# EAGLE design mano_rev_1_2_b (EAGLE 9.4.2)
DATE: 2019.07.02; REV: 1.2b
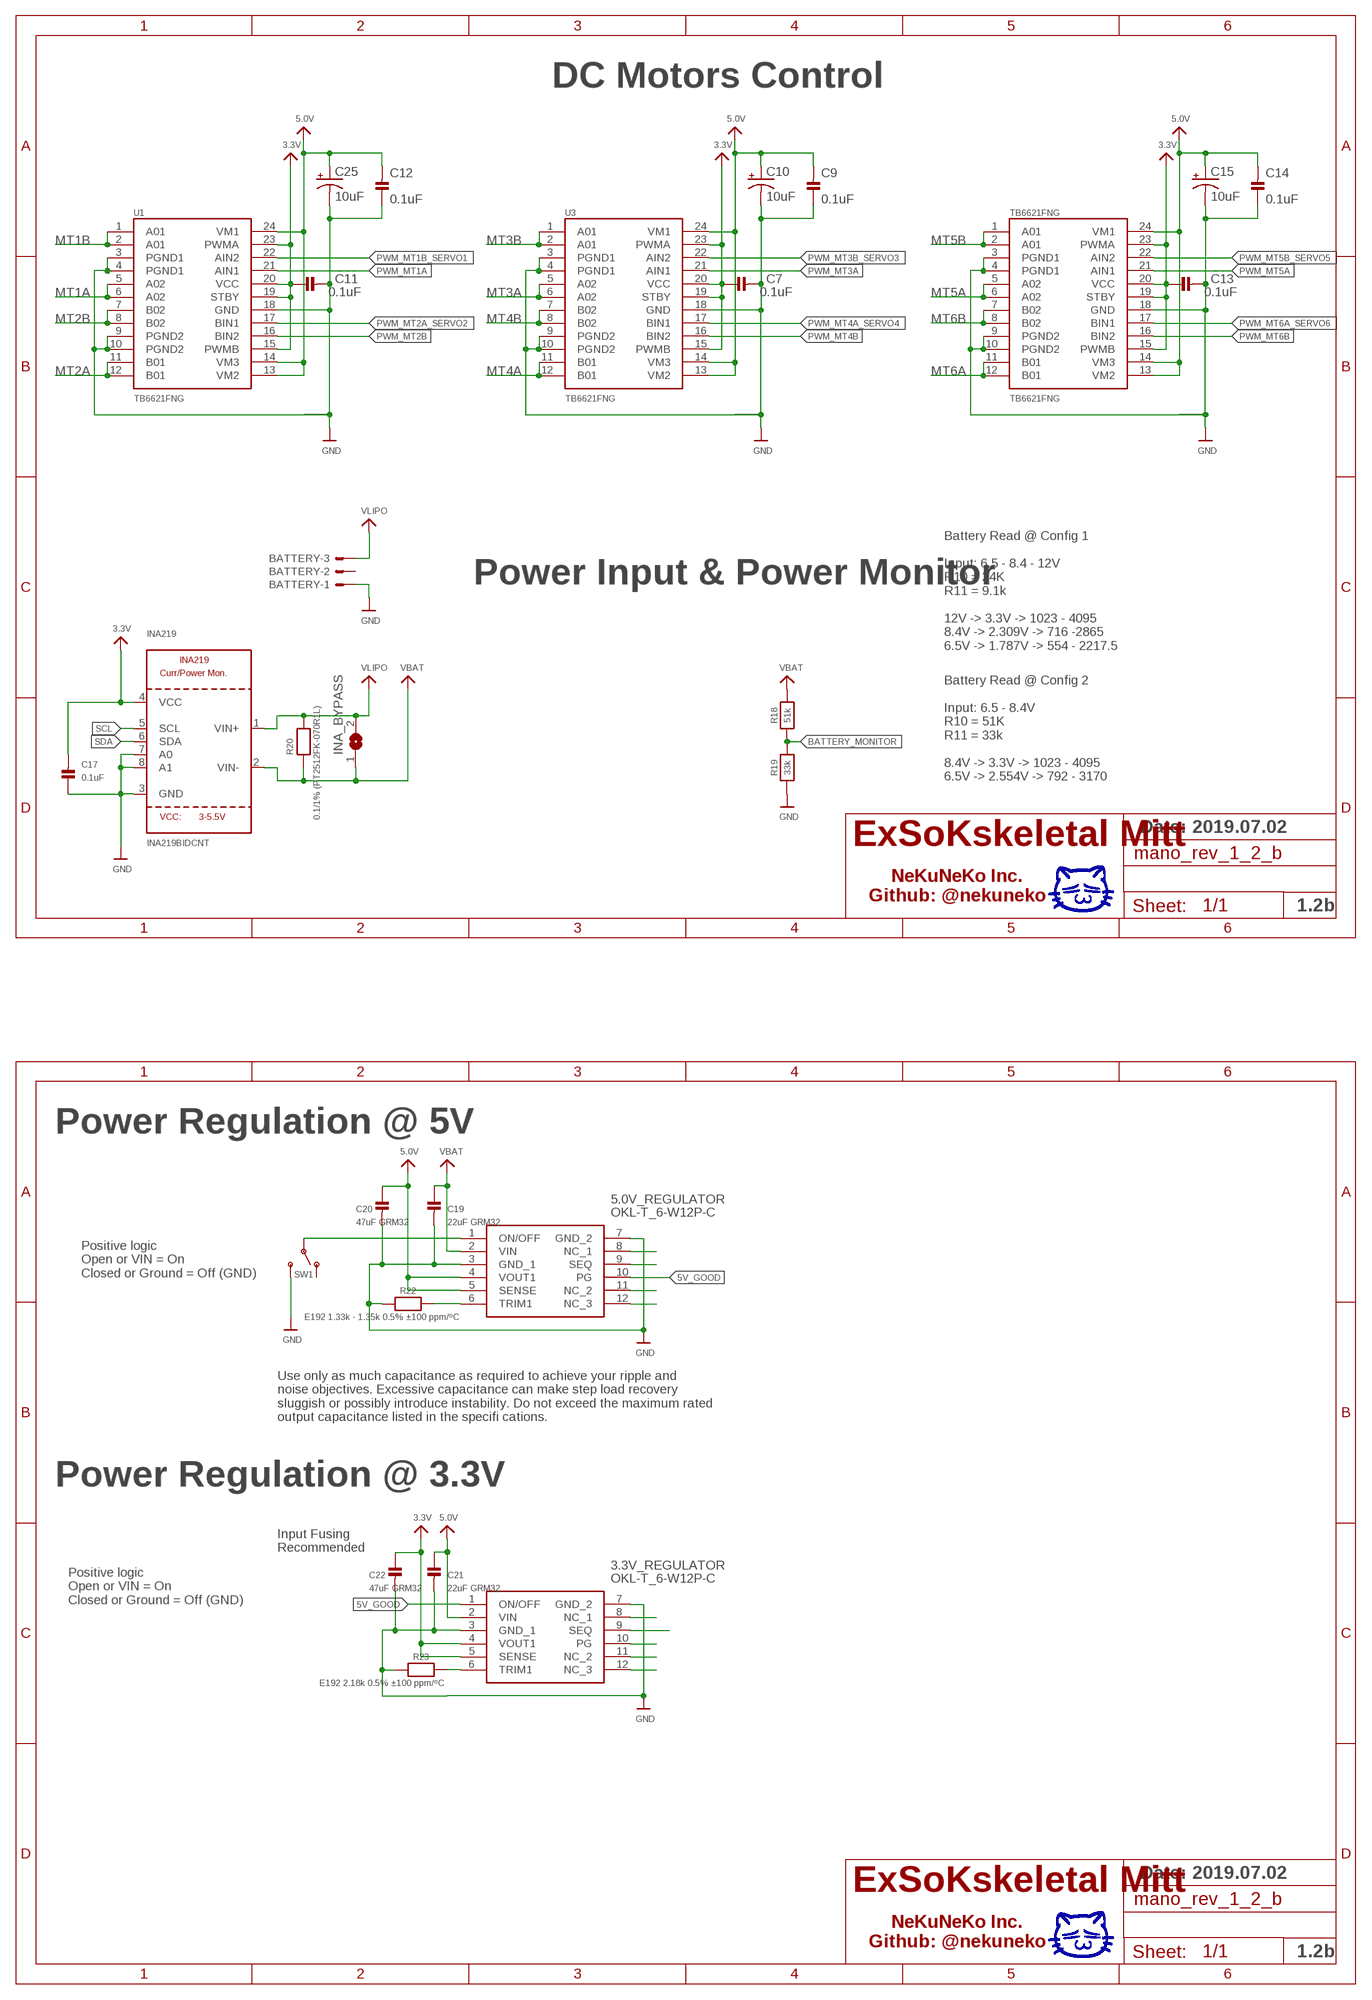
[diagram p0: schematic, sheet 1, part 1 of 2]
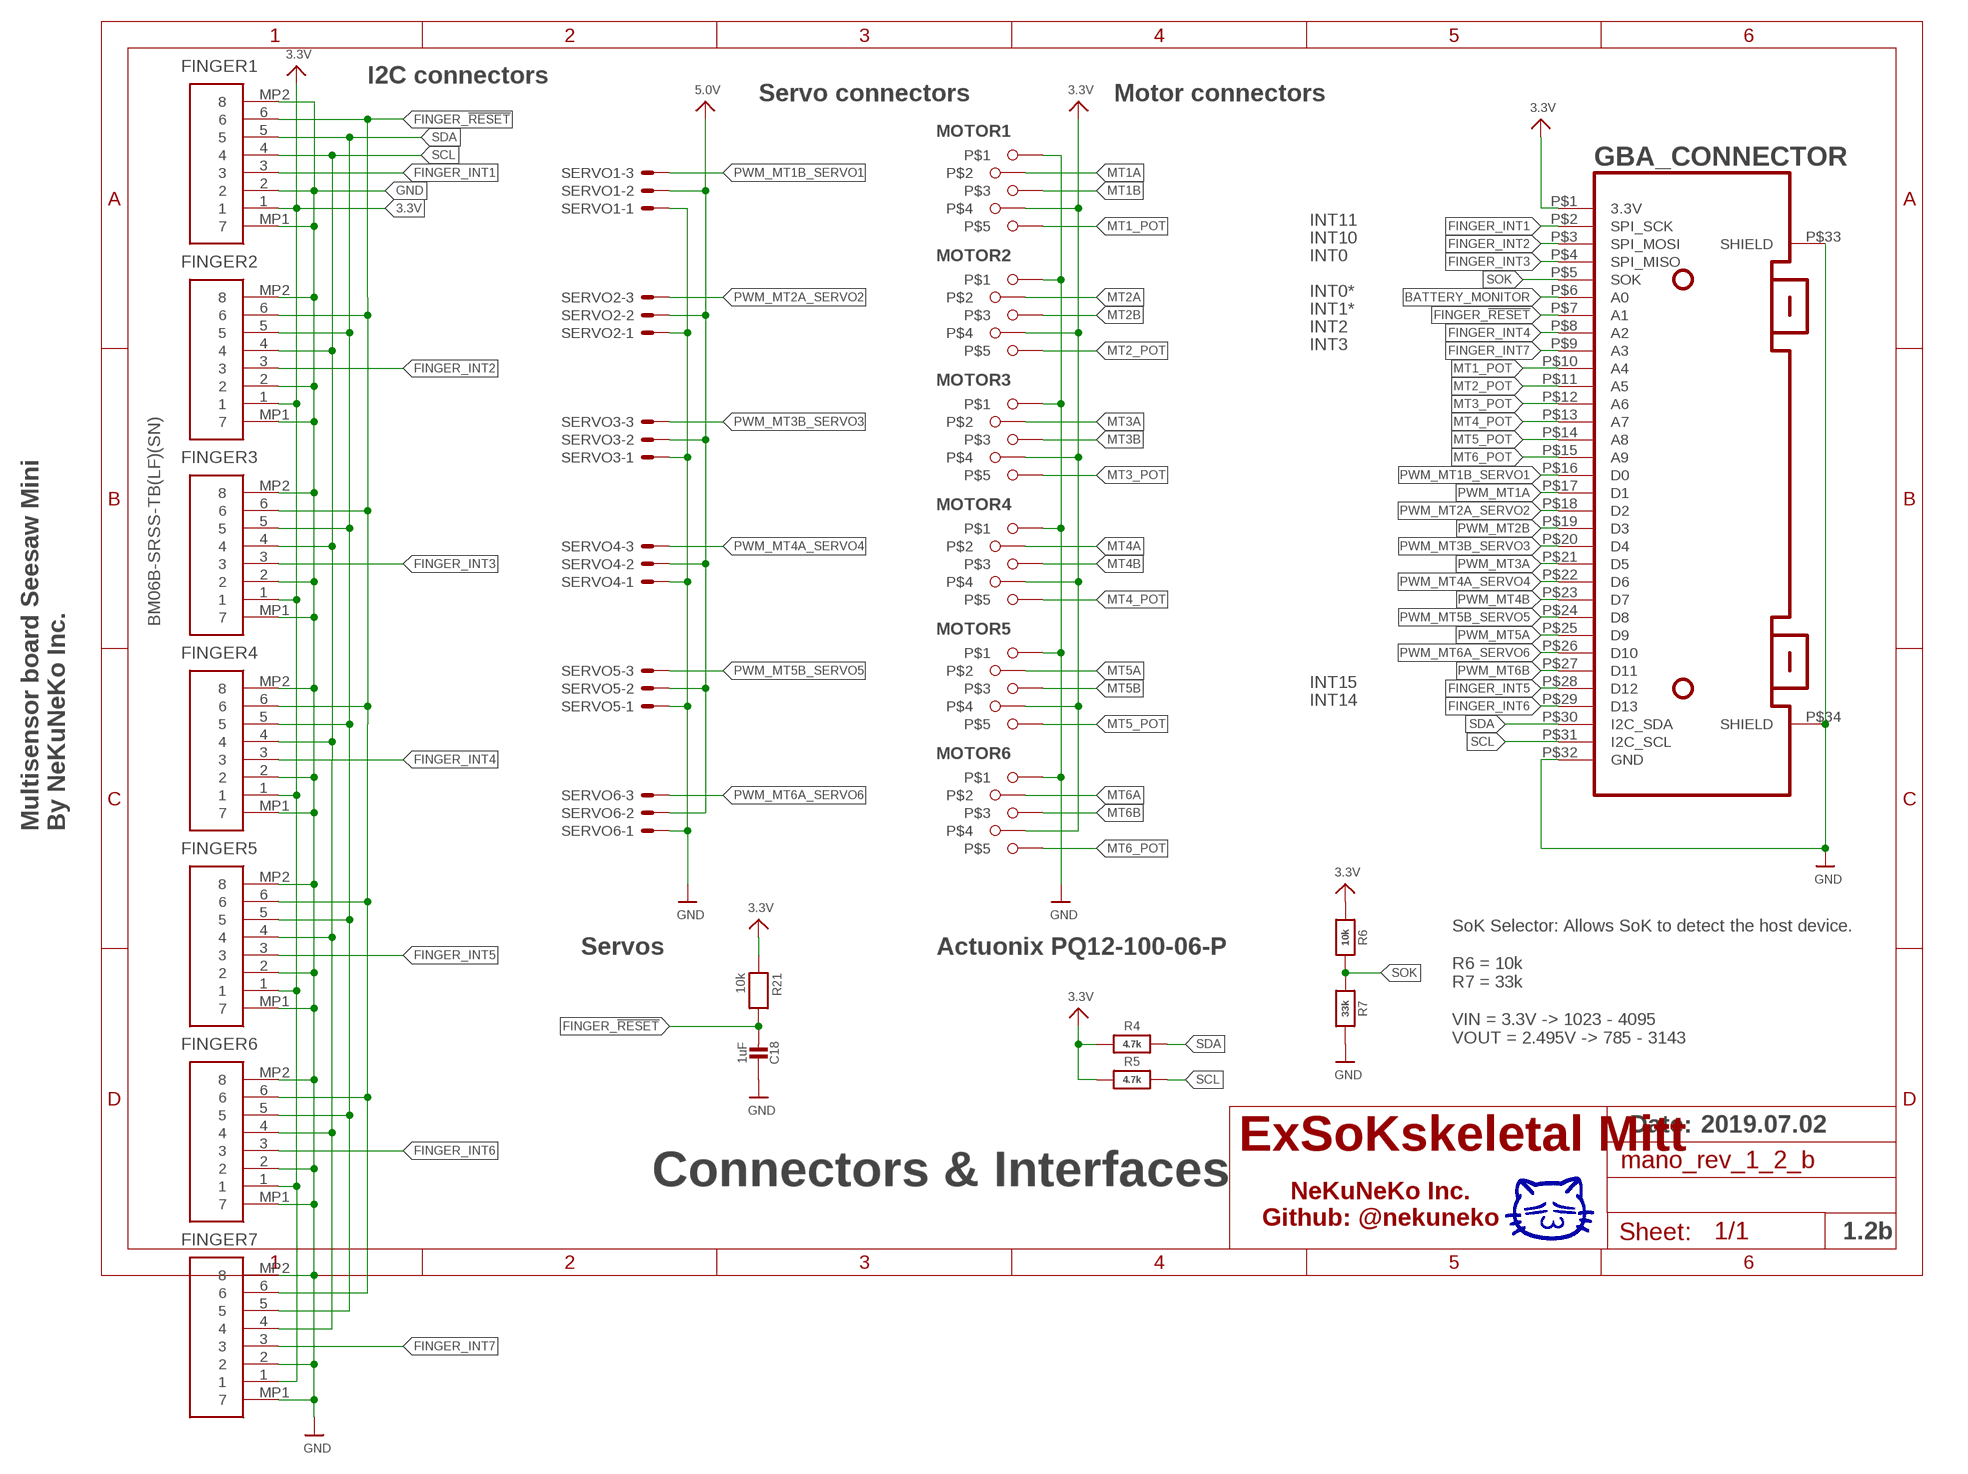
[diagram p1: schematic, sheet 1, part 2 of 2]

## Parts
3.3V_REGULATOR  OKL-T_6-W12P-C  [OKL-T3-W12]
5.0V_REGULATOR  OKL-T_6-W12P-C  [OKL-T3-W12]
BATTERY  JST-XH-03-PIN-LONG-PAD  [JST-XH-03-PACKAGE-LONG-PAD]
C7  0.1uF  CAP_CERAMIC_0603  [_0603]
C9  0.1uF  CAP_CERAMIC_0603  [_0603]
C10  10uF  10UF-POLAR-0603-6.3V-20%(TANT)  [0603-POLAR]
C11  0.1uF  CAP_CERAMIC_0603  [_0603]
C12  0.1uF  CAP_CERAMIC_0603  [_0603]
C13  0.1uF  CAP_CERAMIC_0603  [_0603]
C14  0.1uF  CAP_CERAMIC_0603  [_0603]
C15  10uF  10UF-POLAR-0603-6.3V-20%(TANT)  [0603-POLAR]
C17  0.1uF  CAP_CERAMIC_0603  [_0603]
C18  1uF  CAP_CERAMIC_0603  [MICROBUILDER__0603]
C19  22uF GRM32  CAP_CERAMIC1206  [1206]
C20  47uF GRM32  CAP_CERAMIC1206  [1206]
C21  22uF GRM32  CAP_CERAMIC1206  [1206]
C22  47uF GRM32  CAP_CERAMIC1206  [1206]
C25  10uF  10UF-POLAR-0603-6.3V-20%(TANT)  [0603-POLAR]
FINGER1  BM06B-SRSS-TB(LF)(SN)  [BM06BSRSSTBLFSN]
FINGER2  BM06B-SRSS-TB(LF)(SN)  [BM06BSRSSTBLFSN]
FINGER3  BM06B-SRSS-TB(LF)(SN)  [BM06BSRSSTBLFSN]
FINGER4  BM06B-SRSS-TB(LF)(SN)  [BM06BSRSSTBLFSN]
FINGER5  BM06B-SRSS-TB(LF)(SN)  [BM06BSRSSTBLFSN]
FINGER6  BM06B-SRSS-TB(LF)(SN)  [BM06BSRSSTBLFSN]
FINGER7  BM06B-SRSS-TB(LF)(SN)  [BM06BSRSSTBLFSN]
GBA_CONNECTOR  GBA_CARTRIDGEGBA_CARTRIDGE2  [GBA_CARTRIDGE2]
INA219  INA219BIDCNT  INA219  [SOT23-8]
INA_BYPASS  SOLDERJUMPERREFLOW_NOPASTE  [SOLDERJUMPER_REFLOW_NOPASTE]
MOTOR1  Actuonix PQ12-100-06-P  5PIN  [5PIN]
MOTOR2  Actuonix PQ12-100-06-P  5PIN  [5PIN]
MOTOR3  Actuonix PQ12-100-06-P  5PIN  [5PIN]
MOTOR4  Actuonix PQ12-100-06-P  5PIN  [5PIN]
MOTOR5  Actuonix PQ12-100-06-P  5PIN  [5PIN]
MOTOR6  Actuonix PQ12-100-06-P  5PIN  [5PIN]
R4  4.7k  RESISTOR_0603  [_0603]
R5  4.7k  RESISTOR_0603  [_0603]
R6  10k  RESISTOR_0603  [_0603]
R7  33k  RESISTOR_0603  [_0603]
R18  51k  RESISTOR_0603  [_0603]
R19  33k  RESISTOR_0603  [_0603]
R20  0.1/1% (PT2512FK-070R1L)  RESISTOR2512  [2512]
R21  10k  RESISTOR_0603  [_0603]
R22  E192 1.33k - 1.35k 0.5% ±100 ppm/ºC  RESISTOR_0603  [_0603]
R23  E192 2.18k 0.5% ±100 ppm/ºC  RESISTOR_0603  [_0603]
SERVO1  JST-XH-03-PIN-LONG-PAD  [JST-XH-03-PACKAGE-LONG-PAD]
SERVO2  JST-XH-03-PIN-LONG-PAD  [JST-XH-03-PACKAGE-LONG-PAD]
SERVO3  JST-XH-03-PIN-LONG-PAD  [JST-XH-03-PACKAGE-LONG-PAD]
SERVO4  JST-XH-03-PIN-LONG-PAD  [JST-XH-03-PACKAGE-LONG-PAD]
SERVO5  JST-XH-03-PIN-LONG-PAD  [JST-XH-03-PACKAGE-LONG-PAD]
SERVO6  JST-XH-03-PIN-LONG-PAD  [JST-XH-03-PACKAGE-LONG-PAD]
SW1  SWITCH_SPDT  [SPDT_SMT_SSSS811101]
TB6621FNG  TB6621FNG  [SSOP24]
U1  TB6621FNG  [SSOP24]
U3  TB6621FNG  [SSOP24]

## Nets
3.3V: 3.3V_REGULATOR.4(VOUT1) 3.3V_REGULATOR.5(SENSE) C7.1 C11.1 C13.1 C17.2 C22.1 FINGER1.1 FINGER2.1 FINGER3.1 FINGER4.1 FINGER5.1 FINGER6.1 FINGER7.1 GBA_CONNECTOR.P$1(3.3V) INA219.4(VCC) MOTOR1.4 MOTOR2.4 MOTOR3.4 MOTOR4.4 MOTOR5.4 MOTOR6.4 R4.1 R5.1 R6.1 R21.1 TB6621FNG.15(PWMB) TB6621FNG.19(STBY) TB6621FNG.20(VCC) TB6621FNG.23(PWMA) U1.15(PWMB) U1.19(STBY) U1.20(VCC) U1.23(PWMA) U3.15(PWMB) U3.19(STBY) U3.20(VCC) U3.23(PWMA)
5.0V: 3.3V_REGULATOR.2(VIN) 5.0V_REGULATOR.4(VOUT1) 5.0V_REGULATOR.5(SENSE) C9.2 C10.+ C12.2 C14.2 C15.+ C20.1 C21.1 C25.+ SERVO1.2 SERVO2.2 SERVO3.2 SERVO4.2 SERVO5.2 SERVO6.2 TB6621FNG.13(VM2) TB6621FNG.14(VM3) TB6621FNG.24(VM1) U1.13(VM2) U1.14(VM3) U1.24(VM1) U3.13(VM2) U3.14(VM3) U3.24(VM1)
5V_GOOD: 3.3V_REGULATOR.1(ON/OFF) 5.0V_REGULATOR.10(PG)
BATTERY_MONITOR: GBA_CONNECTOR.P$6(A0) R18.1 R19.2
FINGER_!RESET: C18.2 FINGER1.6 FINGER2.6 FINGER3.6 FINGER4.6 FINGER5.6 FINGER6.6 FINGER7.6 GBA_CONNECTOR.P$7(A1) R21.2
FINGER_INT1: FINGER1.3 GBA_CONNECTOR.P$2(SPI_SCK)
FINGER_INT2: FINGER2.3 GBA_CONNECTOR.P$3(SPI_MOSI)
FINGER_INT3: FINGER3.3 GBA_CONNECTOR.P$4(SPI_MISO)
FINGER_INT4: FINGER4.3 GBA_CONNECTOR.P$8(A2)
FINGER_INT5: FINGER5.3 GBA_CONNECTOR.P$28(D12)
FINGER_INT6: FINGER6.3 GBA_CONNECTOR.P$29(D13)
FINGER_INT7: FINGER7.3 GBA_CONNECTOR.P$9(A3)
GND [gnd]: 3.3V_REGULATOR.3(GND_1) 3.3V_REGULATOR.7(GND_2) 5.0V_REGULATOR.3(GND_1) 5.0V_REGULATOR.7(GND_2) BATTERY.1 C7.2 C9.1 C10.- C11.2 C12.1 C13.2 C14.1 C15.- C17.1 C18.1 C19.2 C20.2 C21.2 C22.2 C25.- FINGER1.2 FINGER1.MP1 FINGER1.MP2 FINGER2.2 FINGER2.MP1 FINGER2.MP2 FINGER3.2 FINGER3.MP1 FINGER3.MP2 FINGER4.2 FINGER4.MP1 FINGER4.MP2 FINGER5.2 FINGER5.MP1 FINGER5.MP2 FINGER6.2 FINGER6.MP1 FINGER6.MP2 FINGER7.2 FINGER7.MP1 FINGER7.MP2 GBA_CONNECTOR.P$32(GND) GBA_CONNECTOR.P$33(SHIELD) GBA_CONNECTOR.P$34(SHIELD) INA219.3(GND) INA219.7(A0) INA219.8(A1) MOTOR1.1 MOTOR2.1 MOTOR3.1 MOTOR4.1 MOTOR5.1 MOTOR6.1 R7.2 R19.1 R22.2 R23.2 SERVO1.1 SERVO2.1 SERVO3.1 SERVO4.1 SERVO5.1 SERVO6.1 SW1.C(S) TB6621FNG.3(PGND1) TB6621FNG.4(PGND1) TB6621FNG.9(PGND2) TB6621FNG.10(PGND2) TB6621FNG.18(GND) U1.3(PGND1) U1.4(PGND1) U1.9(PGND2) U1.10(PGND2) U1.18(GND) U3.3(PGND1) U3.4(PGND1) U3.9(PGND2) U3.10(PGND2) U3.18(GND)
MT1_POT: GBA_CONNECTOR.P$10(A4) MOTOR1.5
MT1A: MOTOR1.2 U1.5(A02) U1.6(A02)
MT1B: MOTOR1.3 U1.1(A01) U1.2(A01)
MT2_POT: GBA_CONNECTOR.P$11(A5) MOTOR2.5
MT2A: MOTOR2.2 U1.11(B01) U1.12(B01)
MT2B: MOTOR2.3 U1.7(B02) U1.8(B02)
MT3_POT: GBA_CONNECTOR.P$12(A6) MOTOR3.5
MT3A: MOTOR3.2 U3.5(A02) U3.6(A02)
MT3B: MOTOR3.3 U3.1(A01) U3.2(A01)
MT4_POT: GBA_CONNECTOR.P$13(A7) MOTOR4.5
MT4A: MOTOR4.2 U3.11(B01) U3.12(B01)
MT4B: MOTOR4.3 U3.7(B02) U3.8(B02)
MT5_POT: GBA_CONNECTOR.P$14(A8) MOTOR5.5
MT5A: MOTOR5.2 TB6621FNG.5(A02) TB6621FNG.6(A02)
MT5B: MOTOR5.3 TB6621FNG.1(A01) TB6621FNG.2(A01)
MT6_POT: GBA_CONNECTOR.P$15(A9) MOTOR6.5
MT6A: MOTOR6.2 TB6621FNG.11(B01) TB6621FNG.12(B01)
MT6B: MOTOR6.3 TB6621FNG.7(B02) TB6621FNG.8(B02)
N$2: 3.3V_REGULATOR.9(SEQ)
N$3: 5.0V_REGULATOR.8(NC_1)
N$4: 5.0V_REGULATOR.9(SEQ)
N$5: 5.0V_REGULATOR.6(TRIM1) R22.1
N$6: 5.0V_REGULATOR.11(NC_2)
N$7: 3.3V_REGULATOR.6(TRIM1) R23.1
N$8: 5.0V_REGULATOR.12(NC_3)
N$9: 3.3V_REGULATOR.8(NC_1)
N$10: 3.3V_REGULATOR.10(PG)
N$11: 3.3V_REGULATOR.11(NC_2)
N$12: 3.3V_REGULATOR.12(NC_3)
PWM_MT1A: GBA_CONNECTOR.P$17(D1) U1.21(AIN1)
PWM_MT1B_SERVO1: GBA_CONNECTOR.P$16(D0) SERVO1.3 U1.22(AIN2)
PWM_MT2A_SERVO2: GBA_CONNECTOR.P$18(D2) SERVO2.3 U1.17(BIN1)
PWM_MT2B: GBA_CONNECTOR.P$19(D3) U1.16(BIN2)
PWM_MT3A: GBA_CONNECTOR.P$21(D5) U3.21(AIN1)
PWM_MT3B_SERVO3: GBA_CONNECTOR.P$20(D4) SERVO3.3 U3.22(AIN2)
PWM_MT4A_SERVO4: GBA_CONNECTOR.P$22(D6) SERVO4.3 U3.17(BIN1)
PWM_MT4B: GBA_CONNECTOR.P$23(D7) U3.16(BIN2)
PWM_MT5A: GBA_CONNECTOR.P$25(D9) TB6621FNG.21(AIN1)
PWM_MT5B_SERVO5: GBA_CONNECTOR.P$24(D8) SERVO5.3 TB6621FNG.22(AIN2)
PWM_MT6A_SERVO6: GBA_CONNECTOR.P$26(D10) SERVO6.3 TB6621FNG.17(BIN1)
PWM_MT6B: GBA_CONNECTOR.P$27(D11) TB6621FNG.16(BIN2)
REG_5V_ON: 5.0V_REGULATOR.1(ON/OFF) SW1.B(P)
SCL: FINGER1.4 FINGER2.4 FINGER3.4 FINGER4.4 FINGER5.4 FINGER6.4 FINGER7.4 GBA_CONNECTOR.P$31(I2C_SCL) INA219.5(SCL) R5.2
SDA: FINGER1.5 FINGER2.5 FINGER3.5 FINGER4.5 FINGER5.5 FINGER6.5 FINGER7.5 GBA_CONNECTOR.P$30(I2C_SDA) INA219.6(SDA) R4.2
SOK: GBA_CONNECTOR.P$5(SOK) R6.2 R7.1
VBAT: 5.0V_REGULATOR.2(VIN) C19.1 INA219.2(VIN-) INA_BYPASS.1 R18.2 R20.1
VLIPO: BATTERY.3 INA219.1(VIN+) INA_BYPASS.2 R20.2
Unconnected: BATTERY.2 SW1.A(O)

## Notes on the sheet
- I2C connectors
- Servo connectors | Motor connectors
- DC Motors Control
- INT11
- INT10
- INT0
- INT0*
- INT1*
- INT2
- INT3
- INT15
- INT14
- Power Input & Power Monitor
- Multisensor board Seesaw Mini
  By NeKuNeKo Inc.
- Battery Read @ Config 1
  
  Input: 6.5 - 8.4 - 12V
  R10 = 24K
  R11 = 9.1k
  
  12V -> 3.3V -> 1023 - 4095
  8.4V -> 2.309V -> 716 -2865
  6.5V -> 1.787V -> 554 - 2217.5
- Servos | Actuonix PQ12-100-06-P
- SoK Selector: Allows SoK to detect the host device.
  
  R6 = 10k
  R7 = 33k 
  
  VIN = 3.3V -> 1023 - 4095
  VOUT = 2.495V -> 785 - 3143
- Battery Read @ Config 2
  
  Input: 6.5 - 8.4V
  R10 = 51K
  R11 = 33k
  
  8.4V -> 3.3V -> 1023 - 4095
  6.5V -> 2.554V -> 792 - 3170
- Date: | Date:
- ExSoKskeletal Mitt | ExSoKskeletal Mitt
- Connectors & Interfaces
- NeKuNeKo Inc.
  Github: @nekuneko
- NeKuNeKo Inc.
  Github: @nekuneko
- Power Regulation @ 5V
- Positive logic
  Open or VIN = On
  Closed or Ground = Off (GND)
- Use only as much capacitance as required to achieve your ripple and
  noise objectives. Excessive capacitance can make step load recovery
  sluggish or possibly introduce instability. Do not exceed the maximum rated
  output capacitance listed in the specifi cations.
- Power Regulation @ 3.3V
- Input Fusing
  Recommended
- Positive logic
  Open or VIN = On
  Closed or Ground = Off (GND)
- Date:
- ExSoKskeletal Mitt
- NeKuNeKo Inc.
  Github: @nekuneko

## Library data of the parts
3.3V_REGULATOR 5.0V_REGULATOR = SamacSys_Parts:OKL-T_6-W12P-C: MURATA POWER SOLUTIONS - OKL-T/6-W12P-C - DC-DC CONVERTER, 0.591V TO 5.5V, MODULE Source: Datasheet <https://power.murata.com/data/power/okl-t6-w12.pdf>; DESCRIPTION: MURATA POWER SOLUTIONS - OKL-T/6-W12P-C - DC-DC CONVERTER, 0.591V TO 5.5V, MODULE; HEIGHT: mm; MANUFACTURER_NAME: Murata Electronics; MANUFACTURER_PART_NUMBER: OKL-T/6-W12P-C; MOUSER_PART_NUMBER: 580-OKL-T/6-W12P-C; MOUSER_PRICE-STOCK: https://www.mouser.com/Search/Refine.aspx?Keyword=580-OKL-T%2F6-W12P-C
BATTERY SERVO1-SERVO6 = JST XH Connectors v1-0:JST-XH-03-PIN: JST XH Connector 2 Pin Wire to board connector. Pitch: 2,54 mm, (0.100") Number of pins: 3 Created by Rembrandt Electronics www.rembrandtelectronics.com
C7 C9 C11-C14 C17 C19-C22 = microbuilder:CAP_CERAMIC: Ceramic Capacitors
C10 C15 C25 = SparkFun-Capacitors:10UF-POLAR: 10.0µF polarized capacitors A capacitor is a passive two-terminal electrical component used to store electrical energy temporarily in an electric field.; MPN: F981A106MMA; PROD_ID: CAP-13210
C18 = m0express:CAP_CERAMIC: Ceramic Capacitors
FINGER1-FINGER7 = 0SoK:BM06B-SRSS-TB(LF)(SN): connector,multipole PCB use,BM06B-SRSS-T JST SH Series, 1mm Pitch 6 Way 1 Row Straight PCB Header, Solder Termination, 1A Source: Datasheet <http://docs-emea.rs-online.com/webdocs/13ce/0900766b813ce45e.pdf>; DESCRIPTION: connector,multipole PCB use,BM06B-SRSS-T JST SH Series, 1mm Pitch 6 Way 1 Row Straight PCB Header, Solder Termination, 1A; HEIGHT: 4.25mm; MANUFACTURER_NAME: JST (JAPAN SOLDERLESS TERMINALS); MANUFACTURER_PART_NUMBER: BM06B-SRSS-TB(LF)(SN); RS_PART_NUMBER: 5468782; RS_PRICE-STOCK: https://uk.rs-online.com/web/p/products/5468782
GBA_CONNECTOR = 0SoK:GBA_CARTRIDGE: GBA Cartridge Slot for NDS - from Aliexpress Gontak SoK main interface
INA219 = microbuilder:INA219: INA219 - I2C Current/Power Monitor Voltage Range: 0-26V Accuracy: 0.5% Temperature: -40°C - 125°C
INA_BYPASS = microbuilder:SOLDERJUMPER: SMD Solder JUMPER Solder the two pads together to create a connection, or remove the solder to break it. REFLOW - Use this footprint for solder paste and reflow ovens. WAVE - Use this footprint for hand-soldering (larger pads). CLOSED - Has a trace between the two pads to ensure it is closed by default. The trace needs to be cut to disable the jumper, and can be closed again by creating a solder bridge between the two pads.
MOTOR1-MOTOR6 = 0SoK:5PIN
R4-R7 R18-R23 = microbuilder:RESISTOR: Resistors 0402 - 0402 Surface Mount Package 22 Ohm 1% 1/16W [Digikey: 311-22.0LRTR-ND] 33 Ohm 5% 1/16W 1.0K 5% 1/16W 1.5K 5% 1/16W 2.0K 1% 1/16W 10.0K 1% 1/16W [Digikey: 311-10.0KLRTR-ND] 10.0K 5% 1/16W [Digikey: RMCF0402JT10K0TR-ND] 12.1K 1% 1/16W [Digikey: 311-22.0LRTR-ND] 100.0K 5% 1/16W 0603 - 0603 Surface Mount Package 0 Ohm 1/10 Watt 1% Resistor 15 Ohm 1/10 Watt 1% Resistor 33 Ohm 1/10 Watt 1% Resistor 49.9 Ohm 1/10 Watt 1% Resistor 100 Ohm 1/10 Watt 1% Resistor 150 Ohm 1/10 Watt 1% Resistor 240 Ohm 1/10 Watt 1% Resistor 390 Ohm 1/10 Watt 1% Resistor 560 Ohm 1/10 Watt 1% Resistor 680 Ohm 1/10 Watt 1% Resistor 750 Ohm 1/10 Watt 1% Resistor 1.0K Ohm 1/10 Watt 1% Resistor 1.5K Ohm 1/10 Watt 1% Resistor 2.0K Ohm 1/10 Watt 1% Resistor 2.2K Ohm 1/10 Watt 1% Resistor 3.3K Ohm 1/10 Watt 1% Resistor 4.7K Ohm 1/10 Watt 1% Resistor 10.0K Ohm 1/10 Watt 1% Resistor 12.0K Ohm 1/10 Watt 1% Resistor 12.1K Ohm 1/10 Watt 1% Resistor 20.0K Ohm 1/10 Watt 1% Resistor 33.0K Ohm 1/10 Watt 1% Resistor 100.0K Ohm 1/10 Watt 1% Resistor 0805 - 0805 Surface Mount Package 0 Ohm 1/8 Watt 1% Resistor 33 Ohm 1/8 Watt 1% Resistor 100 Ohm 1/8 Watt 1% Resistor 150 Ohm 1/8 Watt 1% Resistor 200 Ohm 1/8 Watt 1% Resistor 240 Ohm 1/8 Watt 1% Resistor 330 Ohm 1/8 Watt 1% Resistor 390 Ohm 1/8 Watt 1% Resistor 470 Ohm 1/8 Watt 1% Resistor 1.0K Ohm 1/8 Watt 1% Resistor 1.5K Ohm 1/8 Watt 1% Resistor 2.0K Ohm 1/8 Watt 1% Resistor 4.7K Ohm 1/8 Watt 1% Resistor 5.1K Ohm 1/8 Watt 1% Resistor 5.6K Ohm 1/8 Watt 1% Resistor 10.0K Ohm 1/8 Watt 1% Resistor 22.0K Ohm 1/8 Watt 1% Resistor 33.0K Ohm 1/8 Watt 1% Resistor 100K Ohm 1/8 Watt 1% Resistor 1206 - 1206 Surface Mount Package 2012 - 2010 Surface Mount Package 0.11 Ohm 1/2 Watt 1% Resistor - Digikey: RHM.11UCT-ND
SW1 = microbuilder:SWITCH_SPDT: Switch - SPDT SSSS811101 - Horizontal Two Position SMT, 0.3A 4V [Mouser: 688-SSSS811101]
TB6621FNG U1 U3 = SparkFun:TB6621FNG: Toshiba 1A motor driver

## Net classes
1 power: width 0.254 mm, drill 0.61 mm, clearance 0.254 mm
2 gnd: width 0.254 mm, drill 0.61 mm, clearance 0.254 mm

## Board
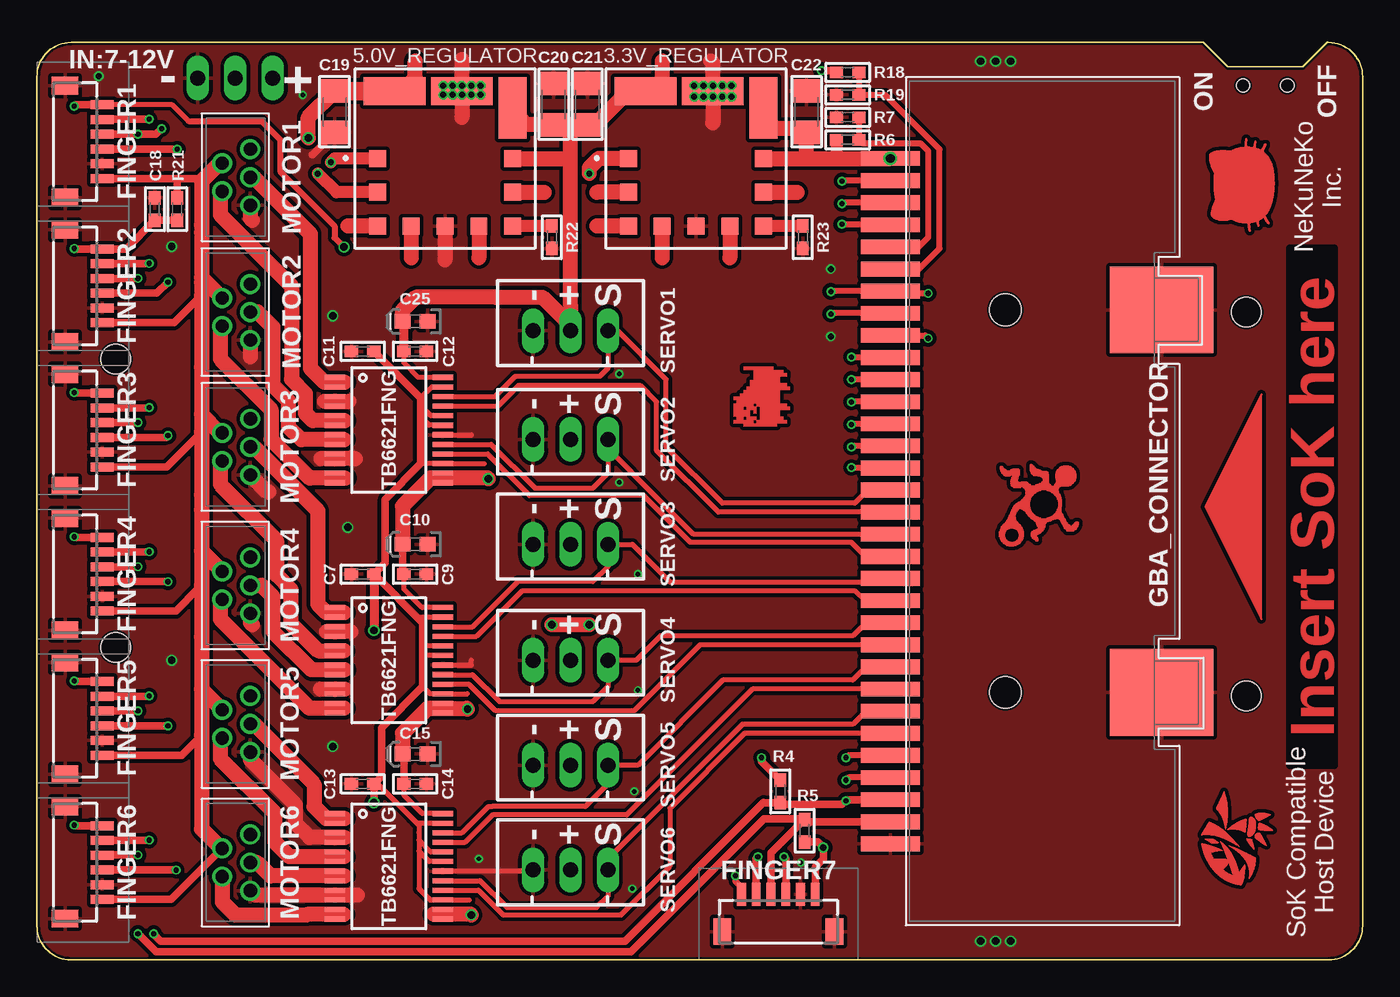
[diagram p2: board, top side]
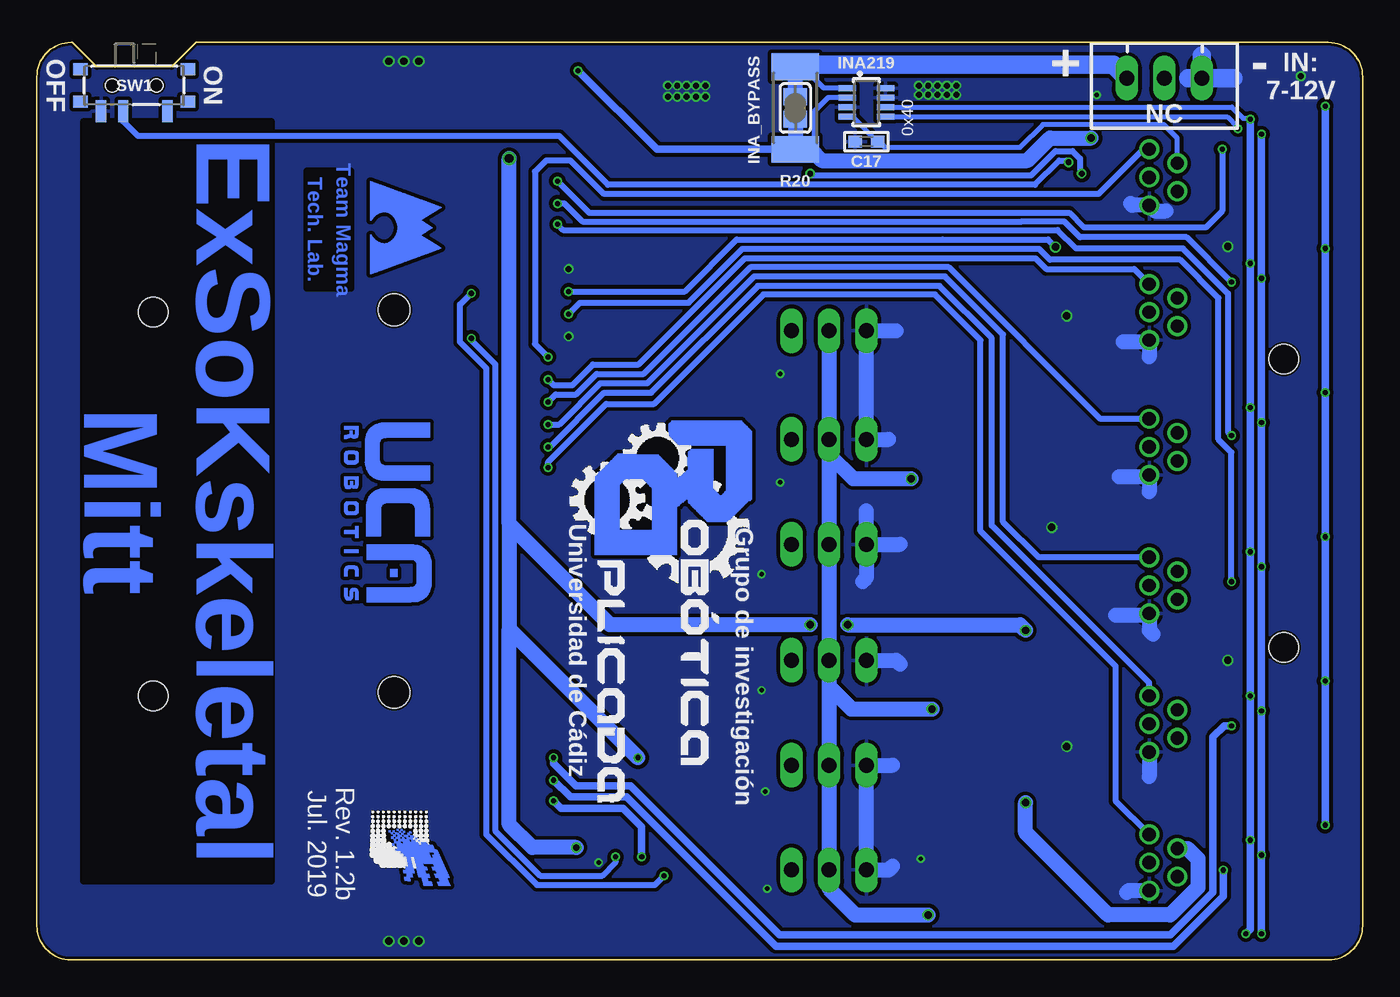
[diagram p3: board, bottom side, seen from below]

Size 89.92 x 62.23 mm. Coordinates in mm from the lower left corner, seen from the top.
Outline: 80.77,60.58 85.85,60.58 87.5,62.23 87.59,62.23 arc-90 89.92,59.91 89.92,2.32 arc-90 87.59,0 2.32,0 arc-90 0,2.32 0,59.91 arc-90 2.32,62.23 79.12,62.23 80.77,60.58
Copper layers (1*16): Top 0.035559375mm / dielectric 1.6mm / Bottom 0.035559375mm
Design rules "nekuneko": minimum track width 6mil, minimum drill 0.3mm, track to track 6mil, track to pad 6mil, pad to pad 6mil, via to via 6mil, smd to smd 6mil, copper to edge 6mil, drill to drill 6mil, minimum pad ring 5mil, minimum via ring 5mil, stop-mask expansion 2.5mil, vias tented up to drill 20mil, thermal gap 10mil
Holes 2 mm at 82.04,43.94 82.04,17.91 5.33,21.21 5.33,40.77
tRestrict: 4 lines

### Footprints (pad centres in the part's own frame; a part is rotated, then mirrored left to right if it is on the bottom)
OKL-T3-W12 = smd 1.15 x 1.15: 1 -4.57,0; 5 4.57,0; 6 4.57,-4.58; 7 0,-4.58; 8 -2.29,-4.58; 9 -4.57,-4.58; 10 -4.57,-2.29; 11 4.57,-2.29; 12 2.29,-4.58 | smd 4.19 x 1.91: 2 -3.43,4.57; 3 1.14,4.57 | smd 1.91 x 4.19: 4 4.57,3.43
JST-XH-03-PACKAGE-LONG-PAD = drill 1.016 long: 1 -2.54,0; 2 0,0; 3 2.54,0
_0603 = smd 0.9 x 0.8: 1 -0.762,0; 2 0.762,0
0603-POLAR = smd 1.1 x 1: + 0.85,0; - -0.85,0
MICROBUILDER__0603 = smd 0.9 x 0.8: 1 -0.762,0; 2 0.762,0
1206 = smd 1.6 x 1.8: 1 -1.4,0; 2 1.4,0
BM06BSRSSTBLFSN = smd 0.6 x 1.55: 1 -2.5,-1.65; 2 -1.5,-1.65; 3 -0.5,-1.65; 4 0.5,-1.65; 5 1.5,-1.65; 6 2.5,-1.65 | smd 1.2 x 1.8: MP1 -3.8,0.875; MP2 3.8,0.875
GBA_CARTRIDGE2 = smd 1 x 4: P$1 5.25,-1.3; P$2 6.75,-1.3; P$3 8.25,-1.3; P$4 9.75,-1.3; P$5 11.25,-1.3; P$6 12.75,-1.3; P$7 14.25,-1.3; P$8 15.75,-1.3; P$9 17.25,-1.3; P$10 18.75,-1.3; P$11 20.25,-1.3; P$12 21.75,-1.3; P$13 23.25,-1.3; P$14 24.75,-1.3; P$15 26.25,-1.3; P$16 27.75,-1.3; P$17 29.25,-1.3; P$18 30.75,-1.3; P$19 32.25,-1.3; P$20 33.75,-1.3; P$21 35.25,-1.3; P$22 36.75,-1.3; P$23 38.25,-1.3; P$24 39.75,-1.3; P$25 41.25,-1.3; P$26 42.75,-1.3; P$27 44.25,-1.3; P$28 45.75,-1.3; P$29 47.25,-1.3; P$30 48.75,-1.3; P$31 50.25,-1.3; P$32 51.75,-1.3 | smd 5.88 x 7: P$33 15.525,17.1; P$34 41.475,17.1 | hole 2.159: 41.475,6.504; 15.525,6.504
SOT23-8 = smd 0.4 x 1.2: 1 -0.975,-1.3; 2 -0.325,-1.3; 3 0.325,-1.3; 4 0.975,-1.3; 5 0.975,1.3; 6 0.325,1.3; 7 -0.325,1.3; 8 -0.975,1.3
SOLDERJUMPER_REFLOW_NOPASTE = smd 1.168 x 1.6: 1 -0.762,0; 2 0.762,0
5PIN = drill 0.9: 1 -1.905,0; 2 -0.953,1.905; 3 0,0; 4 0.953,1.905; 5 1.905,0
2512 = smd 1.8 x 3.2: 1 -2.8,0; 2 2.8,0
SPDT_SMT_SSSS811101 = smd 0.7 x 1.5: A -2.25,1.75; B 0.75,1.75; C 2.25,1.75 | smd 1 x 0.8: SUP1 -3.65,1.1; SUP2 -3.65,-1.1; SUP3 3.65,1.1; SUP4 3.65,-1.1 | hole 0.9: -1.5,0; 1.5,0
SSOP24 = smd 0.348 x 1.397: 1 -3.575,-3.656; 2 -2.925,-3.656; 3 -2.275,-3.656; 4 -1.625,-3.656; 5 -0.975,-3.656; 6 -0.325,-3.656; 7 0.325,-3.656; 8 0.975,-3.656; 9 1.625,-3.656; 10 2.275,-3.656; 11 2.925,-3.656; 12 3.575,-3.656; 13 3.575,3.656; 14 2.925,3.656; 15 2.275,3.656; 16 1.625,3.656; 17 0.975,3.656; 18 0.325,3.656; 19 -0.325,3.656; 20 -0.975,3.656; 21 -1.625,3.656; 22 -2.275,3.656; 23 -2.925,3.656; 24 -3.575,3.656

### Placement (x,y rotation side)
3.3V_REGULATOR  44.7,54.36 0 top
5.0V_REGULATOR  27.69,54.36 0 top
BATTERY  13.46,59.82 180 bottom
C7  22.1,26.16 180 top
C9  25.65,26.16 180 top
C10  25.65,28.19 180 top
C11  22.1,41.27 180 top
C12  25.65,41.27 180 top
C13  22.1,11.94 180 top
C14  25.65,11.94 180 top
C15  25.65,13.97 180 top
C17  33.66,55.5 0 bottom
C18  8,50.93 270 top
C19  20.19,57.53 270 top
C20  35.05,58.04 90 top
C21  37.34,58.04 90 top
C22  52.2,57.53 90 top
C25  25.65,43.31 180 top
FINGER1  2.79,55.5 90 top
FINGER2  2.79,45.72 90 top
FINGER3  2.79,35.94 90 top
FINGER4  2.79,26.16 90 top
FINGER5  2.79,16.38 90 top
FINGER6  2.79,6.6 90 top
FINGER7  50.29,2.79 180 top
GBA_CONNECTOR  59.18,59.62 270 top
INA219  33.66,58.17 270 bottom
INA_BYPASS  38.48,57.78 90 bottom
MOTOR1  14.48,53.09 90 top
MOTOR2  14.48,43.94 90 top
MOTOR3  14.48,34.8 90 top
MOTOR4  14.48,25.4 90 top
MOTOR5  14.48,16 90 top
MOTOR6  14.48,6.6 90 top
R4  2.2k  [_0603]  50.42,11.43 270 top
R5  2.2k  [_0603]  52.07,8.76 90 top
R6  54.99,55.63 0 top
R7  54.99,57.15 180 top
R18  54.99,60.2 180 top
R19  54.99,58.67 0 top
R20  38.48,57.78 90 bottom
R21  9.53,50.93 270 top
R22  34.92,49.02 270 top
R23  51.94,49.02 270 top
SERVO1  36.2,42.67 0 top
SERVO2  36.2,35.31 0 top
SERVO3  36.2,28.19 0 top
SERVO4  36.2,20.32 0 top
SERVO5  36.2,13.21 0 top
SERVO6  36.2,6.1 0 top
SW1  83.31,59.31 180 bottom
TB6621FNG  23.88,6.35 270 top
U1  23.88,35.94 270 top
U3  23.88,20.32 270 top
U$6  [NEKO_6_5_BORDE_TSTOP]  83.95,49.4 90 top
U$7  [SOK_FINISH]  84.07,4.95 90 top
U$8  [DOG_FINISH]  51.31,35.94 90 top
U$9  [MAGMA]  67.31,52.83 270 bottom
U$14  [UCAROBOTICS]  69.34,36.7 270 bottom
U$48  [GIRA_2_DRAWN_14]  54.36,36.7 270 bottom
U$50  [TRIANGLE]  79.25,30.73 0 top
U$51  [DIGIMON]  67.31,10.16 270 bottom
U$52  [BUGS_6]  70.87,27.81 90 top

### Tracks (layer width: path | path; a pad name or v marks a point on that pad's centre or on a via)
3.3V  (via drill 0.35, 0.45, 0.5, 0.61)
  Top 0.35: 26.16,20.83 26.16,18.54 26.66,18.05 U3.15 29.2,18.05 | 26.16,20.83 26.16,21.08 26.16,21.34 | 26.16,21.34 26.16,21.84 26.16,22.86 26.16,23.11 26.03,23.25 U3.23 | U3.20 26.2,21.3 26.16,21.34 | U3.19 26.34,20.64 26.16,20.83 | 27.43,38.87 U1.23 26.8,38.87 26.04,38.1 | C13.1 23.11,11.94 25.4,9.65 25.65,9.4 | 25.91,8.13 25.91,8.64 25.91,9.14 25.65,9.4 | 25.91,8.13 25.91,7.37 | 25.91,7.37 25.91,4.83 26.66,4.08 TB6621FNG.15 29.33,4.08 | TB6621FNG.19 26.6,6.67 25.91,7.37 | TB6621FNG.20 26.71,7.33 25.91,8.13 | TB6621FNG.23 25.78,9.28 25.65,9.4 | U1.20 26.71,36.92 26.04,37.59 | U1.19 26.6,36.27 26.04,36.83 | 26.04,33.66 26.05,33.67 U1.15 30.34,33.67
  Top 0.508: MOTOR6.4 9.12,4.1 FINGER6.1 | 10.92,14.99 11.18,15.24 9.82,13.88 FINGER5.1 | 11.18,25.4 10.92,25.15 9.46,23.69 9.44,23.66 FINGER4.1 | 9.53,53 9.14,53 8.89,53 8.76,53 8,53 7.11,53 FINGER1.1 | 9.53,53 9.65,53 11.53,53 MOTOR1.4 | MOTOR5.4 12.45,17.08 | 26.16,22.86 C7.1 23.62,26.92 23.62,31.24 26.04,33.66 26.04,36.83 26.04,37.59 26.04,38.1 C11.1 | 26.16,23.11 26.16,18.54 23.37,15.75 23.37,12.45 C13.1 v22.86,10.67 | v49.15,13.72 49.15,13.46 R4.1 | R5.1 52.96,8 v53.34,7.62 53.34,6.86 52.79,6.31 FINGER7.1 | R21.1 9.53,53 | FINGER2.1 9.31,43.22 11.18,45.09 | FINGER3.1 8.8,33.44 11.18,35.81 11.18,37.02
  Top 0.61: C7.1 v22.86,22.35
  Top 0.813: R6.1 54.23,54.37
  Top 1.016: MOTOR1.4 12.38,54.04 11.18,52.83 11.18,49.85 | 11.18,49.85 11.18,46.29 MOTOR2.4 | 11.18,49.85 11.18,49.34 | 11.18,49.34 11.18,45.97 11.18,45.09 | 11.18,49.34 11.18,44.96 11.18,37.02 12.45,35.75 MOTOR3.4 | 11.18,31.56 11.18,35.81 11.18,40.2 | 11.18,31.56 11.18,27.75 MOTOR4.4 | 11.18,31.56 11.18,30.54 11.18,25.4 11.18,21.91 11.18,18.35 | MOTOR5.4 11.3,18.22 11.18,18.35 | MOTOR6.4 12.51,7.56 11.18,8.89 11.18,15.24 11.18,18.35 | v37.47,22.73 v34.92,22.73 | 3.3V_REGULATOR.5 49.28,54.37 52.07,54.37 | 52.07,54.37 54.23,54.37 GBA_CONNECTOR.P$1 | 52.07,54.37 52.2,54.49 C22.1 51.94,56.39 49.53,56.39 49.53,57.15 49.27,57.41 3.3V_REGULATOR.4
  Bottom 0.152: 57.88,22.48 57.88,22.45
  Bottom 0.35: MOTOR1.4 12.57,55.75 13.48,56.66 21.7,56.66 23.24,55.12 32.38,55.12 32.77,55.5 C17.2 34.59,57.19 INA219.4 35.21,57.19
  Bottom 1.016: v22.86,22.35 23.24,22.73 v34.92,22.73 | v37.47,22.73 51.05,22.73 57.88,29.56 | MOTOR6.4 11.87,7.56 11.18,6.86 11.18,4.92 13.05,3.05 17.27,3.05 22.86,8.64 v22.86,10.67 | 57.88,29.56 GBA_CONNECTOR.P$1 | 57.88,29.56 57.88,22.48 | v49.15,13.72 57.88,22.45 57.88,21.97 57.88,9.17 56.33,7.62 v53.34,7.62
  other vias: 57.88,54.37
5.0V  (via drill 0.5)
  Top 0.35: TB6621FNG.13 27.23,2.77 26.9,3.1 27.2,3.1 TB6621FNG.14 | U3.13 27.21,17.07 26.75,17.07 | 26.75,17.07 26.5,17.07 | U3.14 27.2,17.07 26.75,17.07 | TB6621FNG.24 26.14,9.93 24.89,11.18 C14.2 | U1.24 25.89,39.52 24.89,40.51 C12.2 | U3.24 26.14,23.89 24.89,25.15 C9.2 | U1.14 30.23,33.02 30.56,32.69 30.68,32.56 30.62,32.63 | v30.61,32.64 30.61,32.37 U1.13
  Top 0.508: C14.2 24.89,13.88 C15.+ | C9.2 24.8,26.25 C10.+
  Top 0.61: C12.2 24.89,43.22 C25.+
  Top 0.813: C25.+ 24.93,43.31
  Top 1.016: v29.46,3.05 29.41,3.1 26.9,3.1 | v29.21,17.02 29.16,17.07 26.75,17.07 | 26.5,17.07 24.8,15.37 C15.+ | C10.+ 24.8,30.78 26.71,32.69 30.56,32.69 | v30.61,32.64 30.62,32.63 | C25.+ 24.8,44.07 25.69,44.96 31.11,44.96 34.29,44.96 36.2,43.05 | 36.2,43.05 36.2,44.45 36.2,54.48 | 36.2,43.05 SERVO1.2 | C20.1 34.92,56.77 | 32.9,57.02 32.26,57.66 5.0V_REGULATOR.4 32.26,57.15 32.77,56.64 C20.1 | 36.2,54.48 36.2,56.64 | 36.2,56.64 C20.1 | 36.2,56.64 C21.1 37.84,56.64 40.13,58.93 3.3V_REGULATOR.2 42.29,58.93 42.42,59.05 42.42,60.96 | 36.2,54.48 36.07,54.36 5.0V_REGULATOR.5
  Bottom 1.016: SERVO4.2 SERVO5.2 SERVO6.2 36.2,4.83 34.42,3.05 v29.46,3.05 | SERVO4.2 SERVO3.2 36.2,33.53 36.2,34.29 | 36.2,34.29 36.2,34.54 36.2,35.05 SERVO2.2 SERVO1.2 | SERVO4.2 36.2,18.54 34.67,17.02 v29.21,17.02 | 36.2,34.29 34.54,32.64 v30.61,32.64
5V_GOOD  (via drill 0.4)
  Top 0.813: 5.0V_REGULATOR.10 20.32,52.07 v19.05,53.34
  Top 1.016: 3.3V_REGULATOR.1 38.1,54.36 37.47,53.72 v37.47,53.34
  Bottom 0.406: v37.47,53.34 37.34,53.21 22.48,53.21 20.83,54.86 19.68,54.86 19.18,54.36 19.18,53.47 v19.05,53.34
BATTERY_MONITOR
  Top 0.406: GBA_CONNECTOR.P$6 59.64,46.69 61.21,48.26 61.21,54.99 57.53,58.67 R19.2 R18.1
FINGER_!RESET  (via drill 0.35, 0.5)
  Top 0.35: FINGER1.6 4.48,58.04 9.14,58.04 10.29,56.9
  Top 0.406: 10.29,56.9 15.24,56.9 16.51,55.63 16.51,53.47 20.19,49.78 20.19,48.99 v20.83,48.35 | v47.37,5.71 47.37,5.33 47.79,4.91 | v60.45,45.21 57.91,45.21 GBA_CONNECTOR.P$7 53.87,45.37 v53.85,45.34
  Top 0.508: R21.2 C18.2 6.06,48.22 FINGER2.6 2.58,48.22 v2.54,48.26 | v2.54,9.14 2.58,9.1 FINGER6.6 | FINGER5.6 2.58,18.88 v2.54,18.92 | FINGER4.6 2.58,28.66 v2.54,28.7 | FINGER3.6 2.58,38.44 v2.54,38.48 | FINGER1.6 2.63,58 v2.54,57.91 | FINGER7.6 47.79,4.91
  Bottom 0.406: v20.83,48.35 21.34,48.86 28.5,48.86 42.45,48.86 45.97,45.34 v53.85,45.34 | v60.45,45.21 61.21,44.45 61.21,41.91 59.44,40.13 59.44,8.51 56.01,5.08 48.01,5.08 v47.37,5.71
  Bottom 0.508: v2.54,9.14 v2.54,18.92 2.54,28.57 v2.54,28.7 v2.54,38.48 v2.54,48.26 v2.54,57.91
FINGER_INT1  (via drill 0.35)
  Top 0.406: GBA_CONNECTOR.P$2 54.64,52.87 v54.61,52.83
  Top 0.508: FINGER1.3 9.52,55 v9.53,54.99
  Bottom 0.406: v9.53,54.99 9.53,50.8 10.64,49.68 18.9,49.68 19.89,50.67 52.45,50.67 v54.61,52.83
FINGER_INT2  (via drill 0.35)
  Top 0.406: 57.84,51.23 GBA_CONNECTOR.P$3 54.67,51.37 v54.61,51.31
  Top 0.508: FINGER2.3 8.14,45.22 v8.89,45.97
  Bottom 0.406: v54.61,51.31 54.14,51.31 52.91,50.08 23.11,50.08 20.24,50.08 19.18,49.02 11.94,49.02 v8.89,45.97
FINGER_INT3  (via drill 0.35)
  Top 0.406: GBA_CONNECTOR.P$4 54.63,49.87 v54.6,49.9
  Top 0.508: FINGER3.3 8.77,35.44 v8.89,35.56
  Bottom 0.406: v8.89,35.56 9.14,35.81 9.14,45.21 12.19,48.26 19.43,48.26 20.69,49.52 54.22,49.52 v54.6,49.9
FINGER_INT4  (via drill 0.35)
  Top 0.406: v8.89,25.65 8.88,25.66 | 57.88,43.69 GBA_CONNECTOR.P$8 53.9,43.87 v53.85,43.81
  Top 0.508: 8.88,25.66 FINGER4.3
  Bottom 0.406: v53.85,43.81 53.09,44.58 45.72,44.58 42.06,48.23 21.95,48.23 21.21,47.5 12.38,47.5 9.78,44.9 9.78,35.31 8.89,34.42 v8.89,25.65
FINGER_INT5  (via drill 0.35)
  Top 0.406: GBA_CONNECTOR.P$28 55.01,13.87 v54.86,13.72
  Top 0.508: FINGER5.3 8.76,15.88 v8.88,15.88 v8.89,15.88
  Bottom 0.508: v54.86,13.72 54.86,13.34 53.34,11.81 49.66,11.81 39.55,1.7 13.03,1.7 10.16,4.57 10.16,15.11 9.4,15.88 v8.89,15.88
FINGER_INT6  (via drill 0.35)
  Top 0.406: GBA_CONNECTOR.P$29 55.04,12.37 v54.86,12.19
  Top 0.508: 57.88,12.19 GBA_CONNECTOR.P$29 | FINGER6.3 v9.44,6.1 v9.45,6.1
  Bottom 0.508: v9.45,6.1 9.45,4.32 12.83,0.94 39.8,0.94 49.91,11.05 53.72,11.05 v54.86,12.19
FINGER_INT7  (via drill 0.35)
  Top 0.406: GBA_CONNECTOR.P$9 60.25,42.37 v60.45,42.16
  Top 0.508: FINGER7.3 50.79,6.87 v50.67,6.99
  Bottom 0.406: v50.67,6.99 50.67,6.6 51.56,5.71 55.78,5.71 58.83,8.77 58.83,40.41 59.33,40.92 60.45,42.04 v60.45,42.16
GND  (via drill 0.3, 0.4, 0.5)
  Top 0.254: U1.4 19.9,37.89 19.5,37.89 19.83,38.22 U1.3
  Top 0.35: TB6621FNG.3 20.57,8.62 20.89,8.3 20.57,7.97 TB6621FNG.4 | SERVO6.1 33.58,6.03 TB6621FNG.18 | U3.9 20.55,18.7 20.89,18.36 20.53,18.36 U3.10 | U3.18 29.46,20 29.46,20.32 | U1.18 29.46,35.62 29.46,35.57
  Top 0.508: C19.2 19.43,55.37 19.43,55.33 18.71,54.61 18.67,54.61
  Top 1.016: MOTOR5.1 14.48,13.59 17.53,10.54 17.53,9.27 18.5,8.3 20.89,8.3 | 21.73,4.39 14.79,4.39 MOTOR6.1 | 14.48,23.11 MOTOR4.1 14.48,22.88 14.61,22.74 | 20.89,18.36 19.23,18.36 | MOTOR2.1 14.48,40.89 | 21.29,22.27 19.63,22.27 | 19.5,37.89 21.16,37.89 | 21.59,34 19.25,34 | MOTOR1.1 14.48,50.31 14.61,50.17 | MOTOR3.1 15.62,31.75 15.75,31.75 | 5.0V_REGULATOR.7 27.69,47.5 | 28.83,61.09 28.83,61.08 5.0V_REGULATOR.3 28.83,57.15 | 45.72,60.96 45.84,60.84 3.3V_REGULATOR.3 45.85,56.77
  Bottom 1.016: MOTOR6.1 15.88,4.7 16,4.57 | MOTOR5.1 14.48,12.45 | 14.22,22.1 14.48,22.35 MOTOR4.1 14.61,23.37 16.76,23.37 | 14.48,31.75 MOTOR3.1 14.61,32.77 16.51,32.77 | 14.48,40.89 MOTOR2.1 14.61,41.91 16.26,41.91 | SERVO4.1 31.62,20.32 31.37,20.07 | 31.88,13.21 SERVO5.1 SERVO6.1 32.13,6.1 31.88,6.35 | SERVO3.1 33.66,25.91 33.91,25.65 | SERVO3.1 31.37,28.19 | SERVO3.1 33.66,30.48 | 32.13,35.31 SERVO2.1 SERVO1.1 31.62,42.67 | 15.75,51.31 15.62,51.18 MOTOR1.1 14.1,50.8 13.34,50.8
  Bottom 1.27: BATTERY.1 8.76,59.82 | BATTERY.1 10.92,61.34 | BATTERY.1 11.81,59.82
  other vias: 64.01,1.27 20.07,43.69 27.56,59.31 27.56,58.67 28.19,58.67 29.46,58.67 30.1,58.67 30.1,59.31 29.46,59.31 28.19,59.31 28.83,59.31 28.83,58.67 44.58,59.31 44.58,58.55 45.21,58.55 46.48,58.55 47.12,58.55 47.12,59.31 46.48,59.31 45.21,59.31 45.85,59.31 45.85,58.55 39.5,39.75 39.5,32.38 29.97,6.86 40.77,26.16 65.02,1.27 66.04,1.27 65.02,60.96 66.04,60.96 64.01,60.96 18.03,58.67 40.77,18.29 40.51,11.43 40.39,4.83 53.85,42.29 53.85,46.86 4.19,59.94 51.82,6.6 21.08,29.34 20.07,14.48 9.14,20.32 9.14,48.39
  pour Bottom (isolate 0.012): 0,0 89.92,0 89.92,62.23 0,62.23
  pour Top (isolate 0.012): 0,0 89.92,0 89.92,62.23 0,62.23
MT1_POT  (via drill 0.35)
  Top 0.406: GBA_CONNECTOR.P$10 55.27,40.87 v55.24,40.89
  Bottom 0.406: v55.24,40.89 56.13,41.78 56.13,53.47 55.37,54.23 53.72,54.23 51.44,51.94 17.91,51.94 14.86,54.99 MOTOR1.5
MT1A
  Top 0.305: U1.5 20.56,36.92 20.89,36.58 20.58,36.27 U1.6
  Top 1.016: MOTOR1.2 12.45,52.01 12.45,50.55 17.27,45.72 17.27,39.37 18.21,38.43 18.21,37.08 18.72,36.58 20.89,36.58
MT1B
  Top 0.305: U1.1 20.56,39.18 21.03,39.18 | 21.03,39.18 20.91,39.18 | U1.2 20.72,38.87 21.03,39.18
  Top 1.016: MOTOR1.3 14.6,53.21 | 14.6,53.21 | 14.6,53.21 18.54,49.26 18.54,40.13 19.49,39.18 20.91,39.18
MT2_POT  (via drill 0.35)
  Top 0.406: GBA_CONNECTOR.P$11 v55.25,39.37 v55.24,39.37
  Bottom 0.406: MOTOR2.5 15.49,46.86 21.46,46.86 22.17,47.57 41.91,47.57 49.1,40.39 52.2,40.39 53.59,38.99 54.86,38.99 v55.24,39.37
MT2A
  Top 0.305: U1.11 20.59,33.02 20.93,32.68 20.53,32.68 U1.12
  Top 1.016: MOTOR2.2 12.45,42.86 12.45,40.77 15.88,37.34 15.88,35.31 18.5,32.68 20.93,32.68
MT2B
  Top 0.305: U1.7 20.54,35.62 20.86,35.29 20.54,34.97 U1.8
  Top 1.016: MOTOR2.3 14.99,43.94 16,42.93 16,38.99 17.04,37.95 17.04,36.2 17.95,35.29 20.86,35.29
MT3_POT  (via drill 0.35)
  Top 0.406: GBA_CONNECTOR.P$12 55.26,37.87 v55.24,37.85
  Bottom 0.406: MOTOR3.5 17.78,36.7 28.07,46.99 41.53,46.99 48.77,39.75 51.94,39.75 53.34,38.35 54.74,38.35 v55.24,37.85
MT3A
  Top 0.35: U3.6 20.54,20.64 20.85,20.96 20.52,21.3 U3.5
  Top 1.016: MOTOR3.2 12.45,33.72 12.45,32.26 16.26,28.45 16.26,26.11 17.22,25.14 17.22,22.82 19.09,20.96 20.85,20.96
MT3B
  Top 0.35: U3.1 20.52,23.89 20.86,23.56 20.54,23.56 U3.2
  Top 1.016: MOTOR3.3 14.73,34.8 19.05,30.48 19.05,24.13 19.62,23.56 20.86,23.56
MT4_POT  (via drill 0.35)
  Top 0.406: GBA_CONNECTOR.P$13 55.29,36.37 v55.24,36.32
  Bottom 0.406: MOTOR4.5 21.97,27.3 24.38,29.72 24.38,42.42 28.32,46.35 41.27,46.35 48.51,39.12 51.69,39.12 54.48,36.32 v55.24,36.32
MT4A
  Top 0.35: U3.11 20.55,17.07 20.86,17.07 20.54,16.75 U3.12
  Top 1.016: MOTOR4.2 12.45,24.32 12.45,23.11 18.49,17.07 20.86,17.07
MT4B
  Top 0.35: U3.8 20.57,19.34 20.89,19.67 20.57,20 U3.7
  Top 1.016: MOTOR4.3 15.24,25.4 16,24.64 16,22.29 18.62,19.67 20.89,19.67
MT5_POT  (via drill 0.35)
  Top 0.406: GBA_CONNECTOR.P$14 55.31,34.87 v55.24,34.8
  Bottom 0.406: MOTOR5.5 14.48,18.8 25.15,29.46 25.15,42.16 28.7,45.72 41.02,45.72 48.26,38.48 51.44,38.48 55.12,34.8 v55.24,34.8
MT5A
  Top 0.35: TB6621FNG.6 20.54,6.67 20.86,6.99 20.52,7.33 TB6621FNG.5
  Top 1.016: MOTOR5.2 12.45,14.92 12.45,13.65 16.13,9.97 16.13,8 17.14,6.99 20.86,6.99
MT5B
  Top 0.35: TB6621FNG.2 20.55,9.28 20.87,9.6 20.55,9.93 TB6621FNG.1
  Top 1.016: 20.87,9.6 19.61,9.6 18.8,10.41 18.8,11.94 14.73,16 MOTOR5.3
MT6_POT  (via drill 0.35)
  Top 0.406: GBA_CONNECTOR.P$15 55.28,33.37 v55.24,33.4
  Bottom 0.406: MOTOR6.5 16.76,10.79 16.76,19.94 25.91,29.08 25.91,42.04 29.01,45.14 40.64,45.14 48.06,37.72 51.31,37.72 55.24,33.78 v55.24,33.4
MT6A
  Top 0.35: TB6621FNG.12 20.53,3.09 20.83,3.09 20.56,3.09 TB6621FNG.11
  Top 1.016: MOTOR6.2 12.57,3.94 13.46,3.05 18.29,3.05 18.33,3.09 20.83,3.09
MT6B
  Top 0.35: TB6621FNG.7 20.54,6.03 20.88,5.69 20.56,5.38 TB6621FNG.8
  Top 1.016: MOTOR6.3 14.94,6.6 15.85,5.69 20.88,5.69
N$2
  Top 1.016: 3.3V_REGULATOR.9 37.98,49.78
N$3
  Top 1.016: 5.0V_REGULATOR.8 25.4,47.63
N$4
  Top 1.016: 5.0V_REGULATOR.9 21.09,49.78
N$5
  Top 0.813: R22.1 5.0V_REGULATOR.6
  Top 1.016: 5.0V_REGULATOR.6
N$6
  Top 1.016: 5.0V_REGULATOR.11 34.41,52.07
N$7
  Top 0.813: R23.1 49.28,49.78 3.3V_REGULATOR.6
N$8
  Top 1.016: 5.0V_REGULATOR.12 29.98,47.63
N$9
  Top 1.016: 3.3V_REGULATOR.8 42.41,47.63
N$10
  Top 1.016: 3.3V_REGULATOR.10 37.98,52.07 37.97,52.07
N$11
  Top 1.016: 3.3V_REGULATOR.11 51.56,52.07
N$12
  Top 1.016: 3.3V_REGULATOR.12 46.99,47.63
PWM_MT1A
  Top 0.35: U1.21 31.29,37.57 32.71,38.99 40.89,38.99 42.04,37.85 42.04,34.54 46.22,30.36 GBA_CONNECTOR.P$17
PWM_MT1B_SERVO1
  Top 0.35: U1.22 31.09,38.22 32.45,39.57 38.18,39.57 38.73,40.13 SERVO1.3 39.37,42.67 42.67,39.37 42.67,34.8 46.49,30.98 55.47,30.98 56.36,31.86 GBA_CONNECTOR.P$16
PWM_MT2A_SERVO2
  Top 0.35: 38.73,34.8 SERVO2.3 | SERVO2.3 38.73,33.02 37.72,32 33.78,32 30.82,34.97 U1.17 | SERVO2.3 38.73,34.67 41.97,31.43 | 41.97,31.43 42.67,30.73 | GBA_CONNECTOR.P$18 44.54,28.86 41.97,31.43
PWM_MT2B
  Top 0.35: U1.16 30.58,34.32 33.4,31.5 41.15,31.5 44.32,28.32 55.24,28.32 56.2,27.36 GBA_CONNECTOR.P$19
PWM_MT3A
  Top 0.35: U3.21 29.82,21.95 32.89,25.02 55.5,25.02 56.15,24.36 GBA_CONNECTOR.P$21
PWM_MT3B_SERVO3
  Top 0.35: U3.22 29.56,22.59 32.62,25.65 37.72,25.65 38.73,26.67 SERVO3.3 40.39,28.19 42.61,25.97 42.97,25.61 57.63,25.61 GBA_CONNECTOR.P$20
PWM_MT4A_SERVO4
  Top 0.35: U3.17 29.55,19.34 31.37,17.53 37.72,17.53 38.73,18.54 SERVO4.3 40.64,20.32 42.3,21.98 55.34,21.98 56.23,22.86 GBA_CONNECTOR.P$22
PWM_MT4B
  Top 0.35: U3.16 29.31,18.7 31.11,16.89 40.51,16.89 44.99,21.36 GBA_CONNECTOR.P$23
PWM_MT5A
  Top 0.35: TB6621FNG.21 29.06,7.97 30.91,9.82 40.01,9.82 48.55,18.36 GBA_CONNECTOR.P$25
PWM_MT5B_SERVO5
  Top 0.35: TB6621FNG.22 28.84,8.62 30.62,10.41 30.86,10.41 37.21,10.41 38.73,11.94 SERVO5.3 40.77,13.21 46.53,18.98 55.34,18.98 56.23,19.86 GBA_CONNECTOR.P$24
PWM_MT6A_SERVO6
  Top 0.35: SERVO6.3 38.73,6.6 | SERVO6.3 38.73,4.32 37.97,3.56 31.88,3.56 30.06,5.38 TB6621FNG.17 | SERVO6.3 38.73,6.86 47.85,15.98 55.34,15.98 56.23,16.86 GBA_CONNECTOR.P$26
PWM_MT6B
  Top 0.35: TB6621FNG.16 29.95,4.72 31.62,3.05 39.62,3.05 42.93,6.35 42.93,10.29 48,15.37 GBA_CONNECTOR.P$27
REG_5V_ON  (via drill 0.4)
  Top 0.813: 5.0V_REGULATOR.1 21.85,54.36 20.19,54.36 v19.94,54.1
  Bottom 0.406: SW1.B 84.06,56.88 83.06,55.88 54.48,55.88 51.18,52.58 22.23,52.58 20.57,54.23 20.07,54.23 v19.94,54.1
SCL  (via drill 0.35)
  Top 0.508: v6.86,1.78 8.08,0.56 40.31,0.56 49.32,9.57 52.03,9.57 R5.2 | R5.2 49.79,7.25 FINGER7.4 | GBA_CONNECTOR.P$31 52.23,9.37 R5.2 | FINGER6.4 4.45,7.11 v6.86,7.11 | v8.46,56.39 8.07,56.01 v6.86,56.01 v6.85,56 FINGER1.4 | FINGER2.4 v6.85,46.22 v6.86,46.23 | FINGER3.4 v6.85,36.44 v6.86,36.45 | FINGER4.4 v6.85,26.66 v6.86,26.67 | FINGER5.4 v6.85,16.88 v6.86,16.89
  Bottom 0.35: v8.46,56.39 8.46,56.46 9.19,57.19 INA219.5
  Bottom 0.508: v6.86,1.78 v6.86,7.11 v6.86,16.89 v6.86,26.67 v6.86,36.45 v6.86,46.23 v6.86,56.01
SDA  (via drill 0.35)
  Top 0.508: v7.92,1.78 7.92,1.73 8.38,1.27 39.88,1.27 49.29,10.69 49.31,10.67 R4.2 50.55,10.54 54.61,10.54 v54.86,10.79 54.93,10.87 GBA_CONNECTOR.P$30 57.83,10.92 | FINGER6.5 7.6,8.1 v7.62,8.13 | v7.62,57.02 4.47,57.02 FINGER1.5 | FINGER2.5 7.6,47.22 v7.62,47.24 | FINGER3.5 7.6,37.44 v7.62,37.47 | FINGER4.5 7.6,27.66 v7.62,27.69 | FINGER5.5 7.6,17.88 v7.62,17.91 | v48.9,6.99 48.77,6.86 48.77,4.47 FINGER7.5
  Bottom 0.35: INA219.6 8.86,57.84 8.1,57.08 7.62,57.08 v7.62,57.02
  Bottom 0.508: v54.86,10.79 54.36,10.29 50.16,10.29 48.9,9.02 v48.9,6.99 | v7.92,1.78 7.62,2.08 v7.62,8.13 v7.62,17.91 v7.62,27.69 v7.62,37.47 v7.62,47.24 v7.62,57.02
SOK
  Top 0.406: GBA_CONNECTOR.P$5 59.62,48.19 60.45,49.02 60.45,54.86 59.94,55.37 56.01,55.37 R6.2 R7.1
VBAT  (via drill 0.35, 0.5)
  Top 0.508: R18.2 53.98,60.2 53.98,60.33 v53.21,60.33
  Top 1.016: 23.24,58.93 5.0V_REGULATOR.2 24.76,58.93 25.65,59.82 25.65,60.96 | v18.41,55.75 18.41,57.15 C19.1
  Top 1.27: 5.0V_REGULATOR.2 C19.1
  Bottom 0.35: 38.1,57.02 INA_BYPASS.1 | INA219.2 36.25,58.49 37.21,57.53 37.21,55.24 37.47,54.98 R20.1
  Bottom 0.508: v53.21,60.33 47.87,54.98 R20.1
  Bottom 1.016: INA_BYPASS.1 38.48,55.38 38.1,55 | R20.1 37.46,54.98 36.7,54.23 22.73,54.23 21.21,55.75 v18.41,55.75
  Bottom 1.27: R20.1 38.11,54.98 38.1,55
VLIPO
  Bottom 0.35: 38.1,58.55 INA_BYPASS.2 | INA219.1 36.53,59.14 37.98,60.59 R20.2
  Bottom 1.016: INA_BYPASS.2 R20.2
  Bottom 1.27: BATTERY.3 16.9,60.71 30.23,60.71 38.35,60.71 R20.2

### Text on the board
Top: Insert SoK here
Bottom: Team Magma / Tech. Lab. | ExSoKskeletal / Mitt
tPlace: IN:7-12V | + | - | ON | OFF | NeKuNeKo / Inc. | - | + | S | - | + | S | - | + | S | - | + | S | - | + | S | - | + | S | SoK Compatible / Host Device
bPlace: + | IN: / 7-12V | - | ON | OFF | NC | 0x40 | Rev. 1.2b / Jul. 2019
tNames: TB6621FNG | TB6621FNG | TB6621FNG
tStop: Insert SoK here
bStop: Team Magma / Tech. Lab. | ExSoKskeletal / Mitt